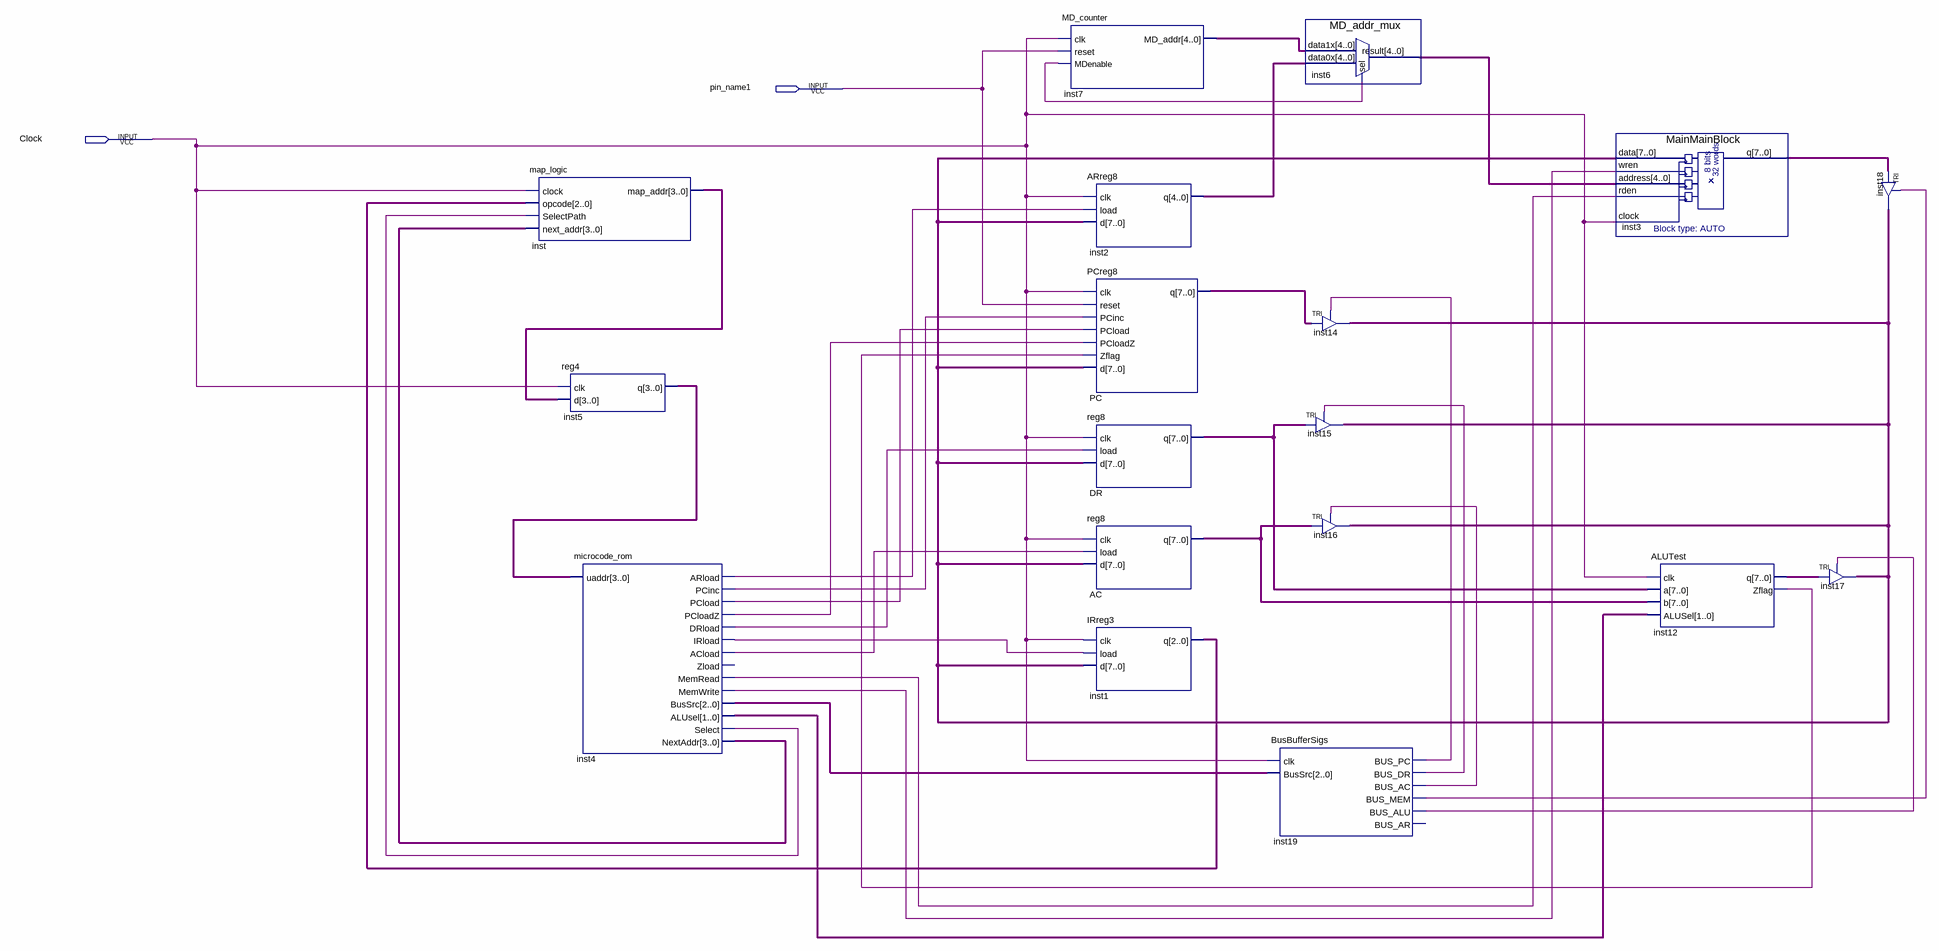
[diagram p0: schematic sheet]
// Quartus schematic CE4720_SimpleCPU.bdf as structural Verilog: 18 symbols, 2 pins
module CE4720_SimpleCPU (
  input  pin_name1,
  input  Clock
);

  wire inst4_acload, inst4_arload, inst4_drload, inst4_irload, inst4_memread, inst4_memwrite, inst4_pcinc,
       inst4_pcload, inst4_pcloadz, inst4_select, inst12_zflag, inst19_bus_ac, inst19_bus_alu, inst19_bus_dr,
       inst19_bus_mem, inst19_bus_pc, undriven;
  wire [1:0] inst4_alusel;
  wire [2:0] inst1_q, inst4_bussrc;
  wire [3:0] inst4_nextaddr, inst5_q, inst_map_addr;
  wire [4:0] inst2_q, inst6_result, inst7_md_addr;
  wire [7:0] AC_q, DR_q, inst3_q, inst12_q, inst14_out, PC_q;

  map_logic inst (
    .clock(Clock), .opcode(inst1_q), .SelectPath(inst4_select), .next_addr(inst4_nextaddr),
    .map_addr(inst_map_addr));
  reg4 inst5 (.clk(Clock), .d(inst_map_addr), .q(inst5_q));
  microcode_rom inst4 (
    .uaddr(inst5_q), .ARload(inst4_arload), .PCinc(inst4_pcinc), .PCload(inst4_pcload),
    .PCloadZ(inst4_pcloadz), .DRload(inst4_drload), .IRload(inst4_irload), .ACload(inst4_acload),
    .MemRead(inst4_memread), .MemWrite(inst4_memwrite), .BusSrc(inst4_bussrc), .ALUsel(inst4_alusel),
    .Select(inst4_select), .NextAddr(inst4_nextaddr));  // open: Zload
  MD_counter inst7 (.clk(Clock), .reset(pin_name1), .MDenable(undriven), .MD_addr(inst7_md_addr));
  ARreg8 inst2 (.clk(Clock), .load(inst4_arload), .d(inst14_out), .q(inst2_q));
  PCreg8 PC (
    .clk(Clock), .reset(pin_name1), .PCinc(inst4_pcinc), .PCload(inst4_pcload), .PCloadZ(inst4_pcloadz),
    .Zflag(inst12_zflag), .d(inst14_out), .q(PC_q));
  reg8 DR (.clk(Clock), .load(inst4_drload), .d(inst14_out), .q(DR_q));
  reg8 AC (.clk(Clock), .load(inst4_acload), .d(inst14_out), .q(AC_q));
  IRreg3 inst1 (.clk(Clock), .load(inst4_irload), .d(inst14_out), .q(inst1_q));
  BusBufferSigs inst19 (
    .clk(Clock), .BusSrc(inst4_bussrc), .BUS_PC(inst19_bus_pc), .BUS_DR(inst19_bus_dr),
    .BUS_AC(inst19_bus_ac), .BUS_MEM(inst19_bus_mem), .BUS_ALU(inst19_bus_alu));  // open: BUS_AR
  MD_addr_mux inst6 (.data1x(inst7_md_addr), .data0x(inst2_q), .sel(undriven), .result(inst6_result));
  TRI inst14[7:0] (.IN(PC_q), .OE(inst19_bus_pc), .OUT(inst14_out));
  TRI inst15[7:0] (.IN(DR_q), .OE(inst19_bus_dr), .OUT(inst14_out));
  TRI inst16[7:0] (.IN(AC_q), .OE(inst19_bus_ac), .OUT(inst14_out));
  MainMainBlock inst3 (
    .data(inst14_out), .wren(inst4_memwrite), .address(inst6_result), .rden(inst4_memread), .clock(Clock),
    .q(inst3_q));
  ALUTest inst12 (.clk(Clock), .a(DR_q), .b(AC_q), .ALUSel(inst4_alusel), .q(inst12_q), .Zflag(inst12_zflag));
  TRI inst17[7:0] (.IN(inst12_q), .OE(inst19_bus_alu), .OUT(inst14_out));
  TRI inst18[7:0] (.IN(inst3_q), .OE(inst19_bus_mem), .OUT(inst14_out));
endmodule
